# EAGLE design UltiMem64_Color (EAGLE 7.7.0)
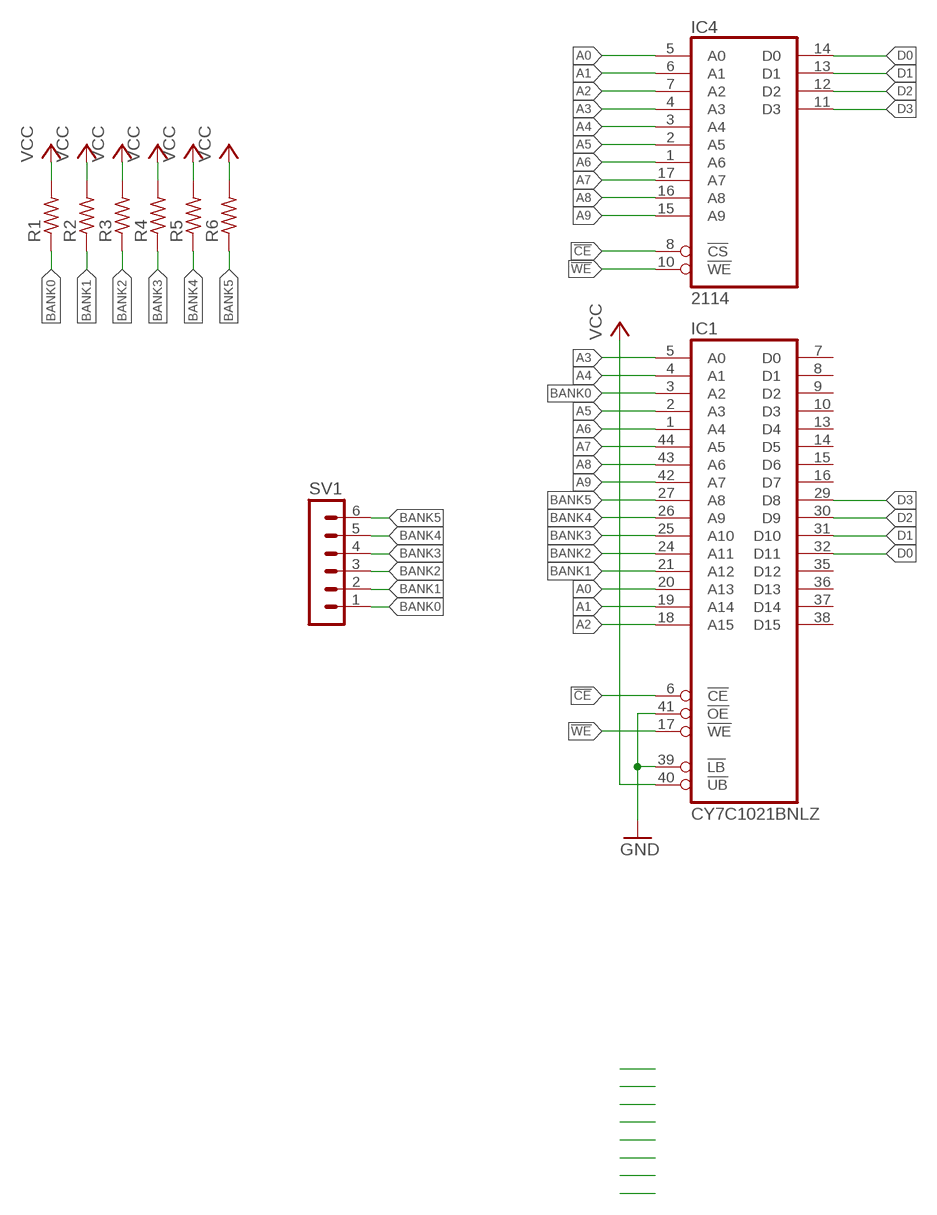
[diagram p0: schematic, sheet 1]

## Parts
IC1  CY7C1021BNLZ  [TSOP44-II]
IC4  2114  2114-S  [DIL18-SMD-REVERSE]
R1  R-US_R0402  [R0402]
R2  R-US_R0402  [R0402]
R3  R-US_R0402  [R0402]
R4  R-US_R0402  [R0402]
R5  R-US_R0402  [R0402]
R6  R-US_R0402  [R0402]
SV1  MA06-1  [MA06-1]

## Nets
!CE: IC1.6(!CE) IC4.8(!CS)
!WE: IC1.17(!WE) IC4.10(!WE)
A0: IC1.20(A13) IC4.5(A0)
A1: IC1.19(A14) IC4.6(A1)
A2: IC1.18(A15) IC4.7(A2)
A3: IC1.5(A0) IC4.4(A3)
A4: IC1.4(A1) IC4.3(A4)
A5: IC1.2(A3) IC4.2(A5)
A6: IC1.1(A4) IC4.1(A6)
A7: IC1.44(A5) IC4.17(A7)
A8: IC1.43(A6) IC4.16(A8)
A9: IC1.42(A7) IC4.15(A9)
BANK0: IC1.3(A2) R1.1 SV1.1
BANK1: IC1.21(A12) R2.1 SV1.2
BANK2: IC1.24(A11) R3.1 SV1.3
BANK3: IC1.25(A10) R4.1 SV1.4
BANK4: IC1.26(A9) R5.1 SV1.5
BANK5: IC1.27(A8) R6.1 SV1.6
D0: IC1.32(D11) IC4.14(D0)
D1: IC1.31(D10) IC4.13(D1)
D2: IC1.30(D9) IC4.12(D2)
D3: IC1.29(D8) IC4.11(D3)
GND: IC1.39(!LB) IC1.41(!OE)
VCC: IC1.40(!UB) R1.2 R2.2 R3.2 R4.2 R5.2 R6.2
Unconnected: IC1.7(D0) IC1.8(D1) IC1.9(D2) IC1.10(D3) IC1.13(D4) IC1.14(D5) IC1.15(D6) IC1.16(D7) IC1.35(D12) IC1.36(D13) IC1.37(D14) IC1.38(D15)

## Power pins joined to a net without a drawn wire
GND: IC1.12(GND) IC1.34(GND) IC4.9(GND)
VCC: IC1.11(VCC) IC1.33(VCC) IC4.18(VCC)

## Library data of the parts
IC1 = memory-cypress-jlb:CY7C1021BNL
IC4 = memory:2114: MEMORY
R1-R6 = resistor:R-US_: RESISTOR, American symbol
SV1 = con-lstb-rp:MA06-1: PIN HEADER; OC_FARNELL: unknown; OC_NEWARK: unknown

## Board
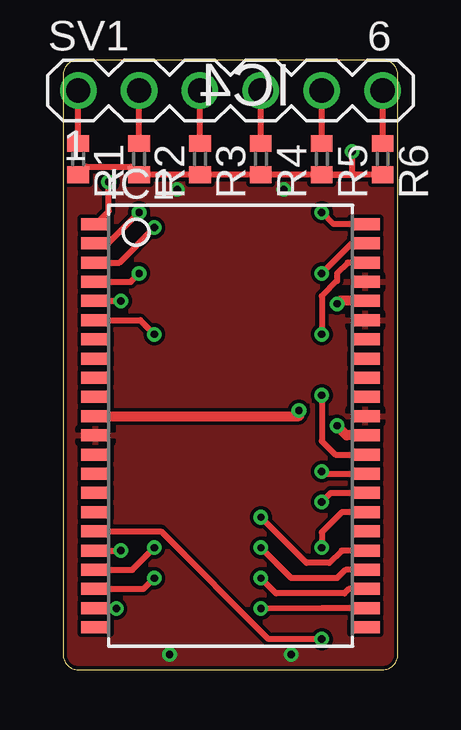
[diagram p1: board, top side]
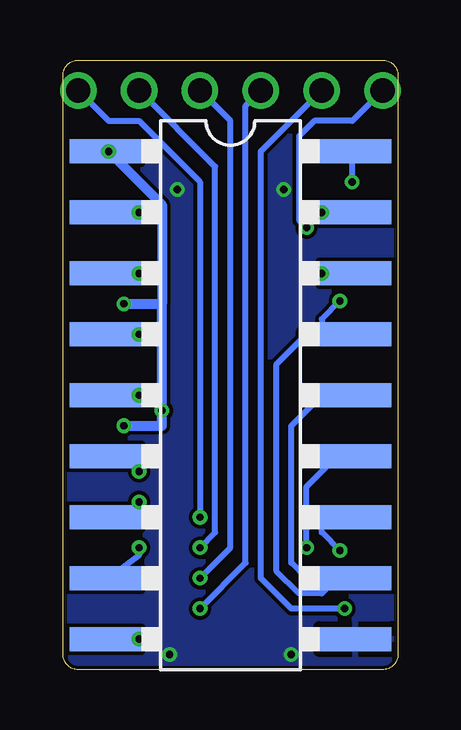
[diagram p2: board, bottom side, seen from below]

Size 13.97 x 25.4 mm. Coordinates in mm from the lower left corner, seen from the top.
Outline: 0,24.77 0,0.64 arc90 0.64,0 13.34,0 arc90 13.97,0.64 13.97,24.77 arc90 13.34,25.4 0.64,25.4 arc90 0,24.77
Copper layers (1*16): Top 0.035mm / dielectric 1.5mm / Bottom 0.035mm
Design rules "hackvana": minimum track width 6mil, minimum drill 0.3mm, track to track 6mil, track to pad 6mil, pad to pad 6mil, via to via 6mil, smd to smd 0mil, copper to edge 6mil, drill to drill 6mil, minimum pad ring 10mil, minimum via ring 6mil, stop-mask expansion 2mil, vias tented up to drill 100mil, thermal gap 10mil

### Footprints (pad centres in the part's own frame; a part is rotated, then mirrored left to right if it is on the bottom)
TSOP44-II = smd 0.5 x 1.2: 1 -8.4,-5.627; 2 -7.6,-5.627; 3 -6.8,-5.627; 4 -6,-5.627; 5 -5.2,-5.627; 6 -4.4,-5.627; 7 -3.6,-5.627; 8 -2.8,-5.627; 9 -2,-5.627; 10 -1.2,-5.627; 11 -0.4,-5.627; 12 0.4,-5.627; 13 1.2,-5.627; 14 2,-5.627; 15 2.8,-5.627; 16 3.6,-5.627; 17 4.4,-5.627; 18 5.2,-5.627; 19 6,-5.627; 20 6.8,-5.627; 21 7.6,-5.627; 22 8.4,-5.627; 23 8.4,5.627; 24 7.6,5.627; 25 6.8,5.627; 26 6,5.627; 27 5.2,5.627; 28 4.4,5.627; 29 3.6,5.627; 30 2.8,5.627; 31 2,5.627; 32 1.2,5.627; 33 0.4,5.627; 34 -0.4,5.627; 35 -1.2,5.627; 36 -2,5.627; 37 -2.8,5.627; 38 -3.6,5.627; 39 -4.4,5.627; 40 -5.2,5.627; 41 -6,5.627; 42 -6.8,5.627; 43 -7.6,5.627; 44 -8.4,5.627
DIL18-SMD-REVERSE = smd 1 x 3 bottom: 1 -8.89,-5.205; 2 -6.35,-5.205; 3 -3.81,-5.205; 4 -1.27,-5.205; 5 1.27,-5.205; 6 3.81,-5.205; 7 6.35,-5.205; 8 8.89,-5.205; 9 11.43,-5.205; 10 11.43,5.205; 11 8.89,5.205; 12 6.35,5.205; 13 3.81,5.205; 14 1.27,5.205; 15 -1.27,5.205; 16 -3.81,5.205; 17 -6.35,5.205; 18 -8.89,5.205
R0402 = smd 0.7 x 0.9: 1 -0.65,0; 2 0.65,0
MA06-1 = drill 1.016: 1 -6.35,0; 2 -3.81,0; 3 -1.27,0; 4 1.27,0; 5 3.81,0; 6 6.35,0

### Placement (x,y rotation side)
IC1  6.99,10.16 270 top
IC4  6.99,12.7 270 top
R1  0.64,21.27 270 top
R2  3.17,21.27 270 top
R3  5.71,21.27 270 top
R4  8.26,21.27 270 top
R5  10.79,21.27 270 top
R6  13.34,21.27 270 top
SV1  6.99,24.13 0 top

### Tracks (layer width: path | path; a pad name or v marks a point on that pad's centre or on a via)
!CE  (via drill 0.3)
  Top 0.254: IC1.6 3.22,14.56 v3.81,13.97
  Bottom 0.254: v3.81,13.97 5.08,12.7 5.08,4.13 4.13,3.17 3.17,3.17 2.54,3.81 IC4.8
!WE  (via drill 0.3)
  Top 0.254: IC1.17 4.08,5.76 8.57,1.27 v10.79,1.27
  Bottom 0.254: IC4.10 v10.79,1.27
A0  (via drill 0.3)
  Top 0.254: IC1.20 3.36,3.36 v3.81,3.81
  Bottom 0.254: v3.81,3.81 4.45,4.45 4.45,10.16 3.17,11.43 IC4.5
A1  (via drill 0.3)
  Top 0.254: IC1.19 2.89,4.16 v3.81,5.08
  Bottom 0.254: v3.81,5.08 3.81,7.62 2.54,8.89 IC4.6
A2  (via drill 0.3)
  Top 0.254: IC1.18 v2.42,4.96
  Bottom 0.254: v2.42,4.96 3.17,5.71 3.17,6.35 IC4.7
A3  (via drill 0.3)
  Top 0.254: IC1.5 v2.42,15.36
  Bottom 0.254: v2.42,15.36 3.17,14.61 3.17,13.97 IC4.4
A4  (via drill 0.3)
  Top 0.254: IC1.4 2.83,16.16 v3.17,16.51
  Bottom 0.254: v3.17,16.51 IC4.3
A5  (via drill 0.3)
  Top 0.254: IC1.2 1.89,17.76 v3.17,19.05
  Bottom 0.254: v3.17,19.05 IC4.2
A6  (via drill 0.3)
  Top 0.254: IC1.1 1.91,19.11 v1.91,20.32
  Bottom 0.254: v1.91,20.32 1.91,21.46 IC4.1
A7  (via drill 0.3)
  Top 0.254: IC1.44 11.29,18.56 v10.79,19.05
  Bottom 0.254: v10.79,19.05 IC4.17
A8  (via drill 0.3)
  Top 0.254: IC1.43 12.04,17.76 v10.79,16.51
  Bottom 0.254: v10.79,16.51 IC4.16
A9  (via drill 0.3)
  Top 0.254: IC1.42 11.88,16.96 11.43,16.51 11.43,16.19 10.79,15.56 v10.79,13.97
  Bottom 0.254: v10.79,13.97 IC4.15
BANK0  (via drill 0.3)
  Top 0.254: IC1.3 2.35,16.96 v3.81,18.41 | R1.1 SV1.1
  Bottom 0.254: SV1.1 1.91,22.86 3.49,22.86 4.13,22.23 4.13,18.73 v3.81,18.41
BANK1  (via drill 0.3)
  Top 0.254: IC1.21 2.2,2.56 v2.22,2.54 | R2.1 SV1.2
  Bottom 0.254: v2.22,2.54 4.45,2.54 5.71,3.81 5.71,21.59 SV1.2
BANK2  (via drill 0.3)
  Top 0.254: IC1.24 10.81,2.56 v8.26,2.54 | R3.1 SV1.3
  Bottom 0.254: v8.26,2.54 6.35,4.45 6.35,23.5 SV1.3
BANK3  (via drill 0.3)
  Top 0.254: IC1.25 11.93,3.36 11.75,3.17 8.89,3.17 v8.26,3.81 | R4.1 SV1.4
  Bottom 0.254: v8.26,3.81 6.99,5.08 6.99,22.86 SV1.4
BANK4  (via drill 0.3)
  Top 0.254: IC1.26 11.78,4.16 11.43,3.81 9.53,3.81 v8.26,5.08 | R5.1 SV1.5
  Bottom 0.254: v8.26,5.08 7.62,5.71 7.62,20.95 SV1.5
BANK5  (via drill 0.3)
  Top 0.254: IC1.27 11.63,4.96 11.11,4.45 10.16,4.45 v8.26,6.35 | R6.1 SV1.6
  Bottom 0.254: SV1.6 12.06,22.86 10.79,22.86 8.26,20.32 v8.26,6.35
D0  (via drill 0.3)
  Top 0.254: v10.79,11.43 10.79,9.53 11.36,8.96 IC1.32
  Bottom 0.254: IC4.14 v10.79,11.43
D1  (via drill 0.3)
  Top 0.254: v10.79,8.26 10.89,8.16 IC1.31
  Bottom 0.254: IC4.13 11.43,8.89 v10.79,8.26
D2  (via drill 0.3)
  Top 0.254: v10.79,6.99 11.17,7.36 IC1.30
  Bottom 0.254: IC4.12 11.43,6.35 v10.79,6.99
D3  (via drill 0.3)
  Top 0.254: IC1.29 11.64,6.56 10.79,5.71 v10.79,5.08
  Bottom 0.254: IC4.11 12.06,3.81 10.79,4.76 v10.79,5.08
GND  (via drill 0.3)
  other vias: 4.76,20 9.21,20 4.45,0.64 9.53,0.64
  pour Top: 13.97,24.77 13.97,0.64 arc-90 13.34,0 0.64,0 arc-90 0,0.64 0,24.77 arc-90 0.64,25.4 13.34,25.4 arc-90
  pour Bottom: 13.97,24.77 13.97,0.64 arc-90 13.34,0 0.64,0 arc-90 0,0.64 0,24.77 arc-90 0.64,25.4 13.34,25.4 arc-90
VCC  (via drill 0.3)
  Top 0.254: R6.2 R5.2 | R5.2 R4.2 R3.2 R2.2 3.17,20.64 2.86,20.95 0.97,20.95 R1.2 | v12.06,21.59 12.06,20.64 12.05,20.62 R5.2
  Top 0.406: IC1.40 11.55,15.36 v11.43,15.24 | IC1.33 11.83,9.76 v11.43,10.16 | IC1.11 9.84,10.56 v9.84,10.79
  Bottom 0.406: v11.43,15.24 9.84,15.24 | v11.43,10.16 9.84,10.16 v9.84,10.79 9.84,15.24 | IC4.18 v12.06,21.59 9.84,19.37 9.84,15.24